# EAGLE design LilyPad-Simple (EAGLE 7.2.0)
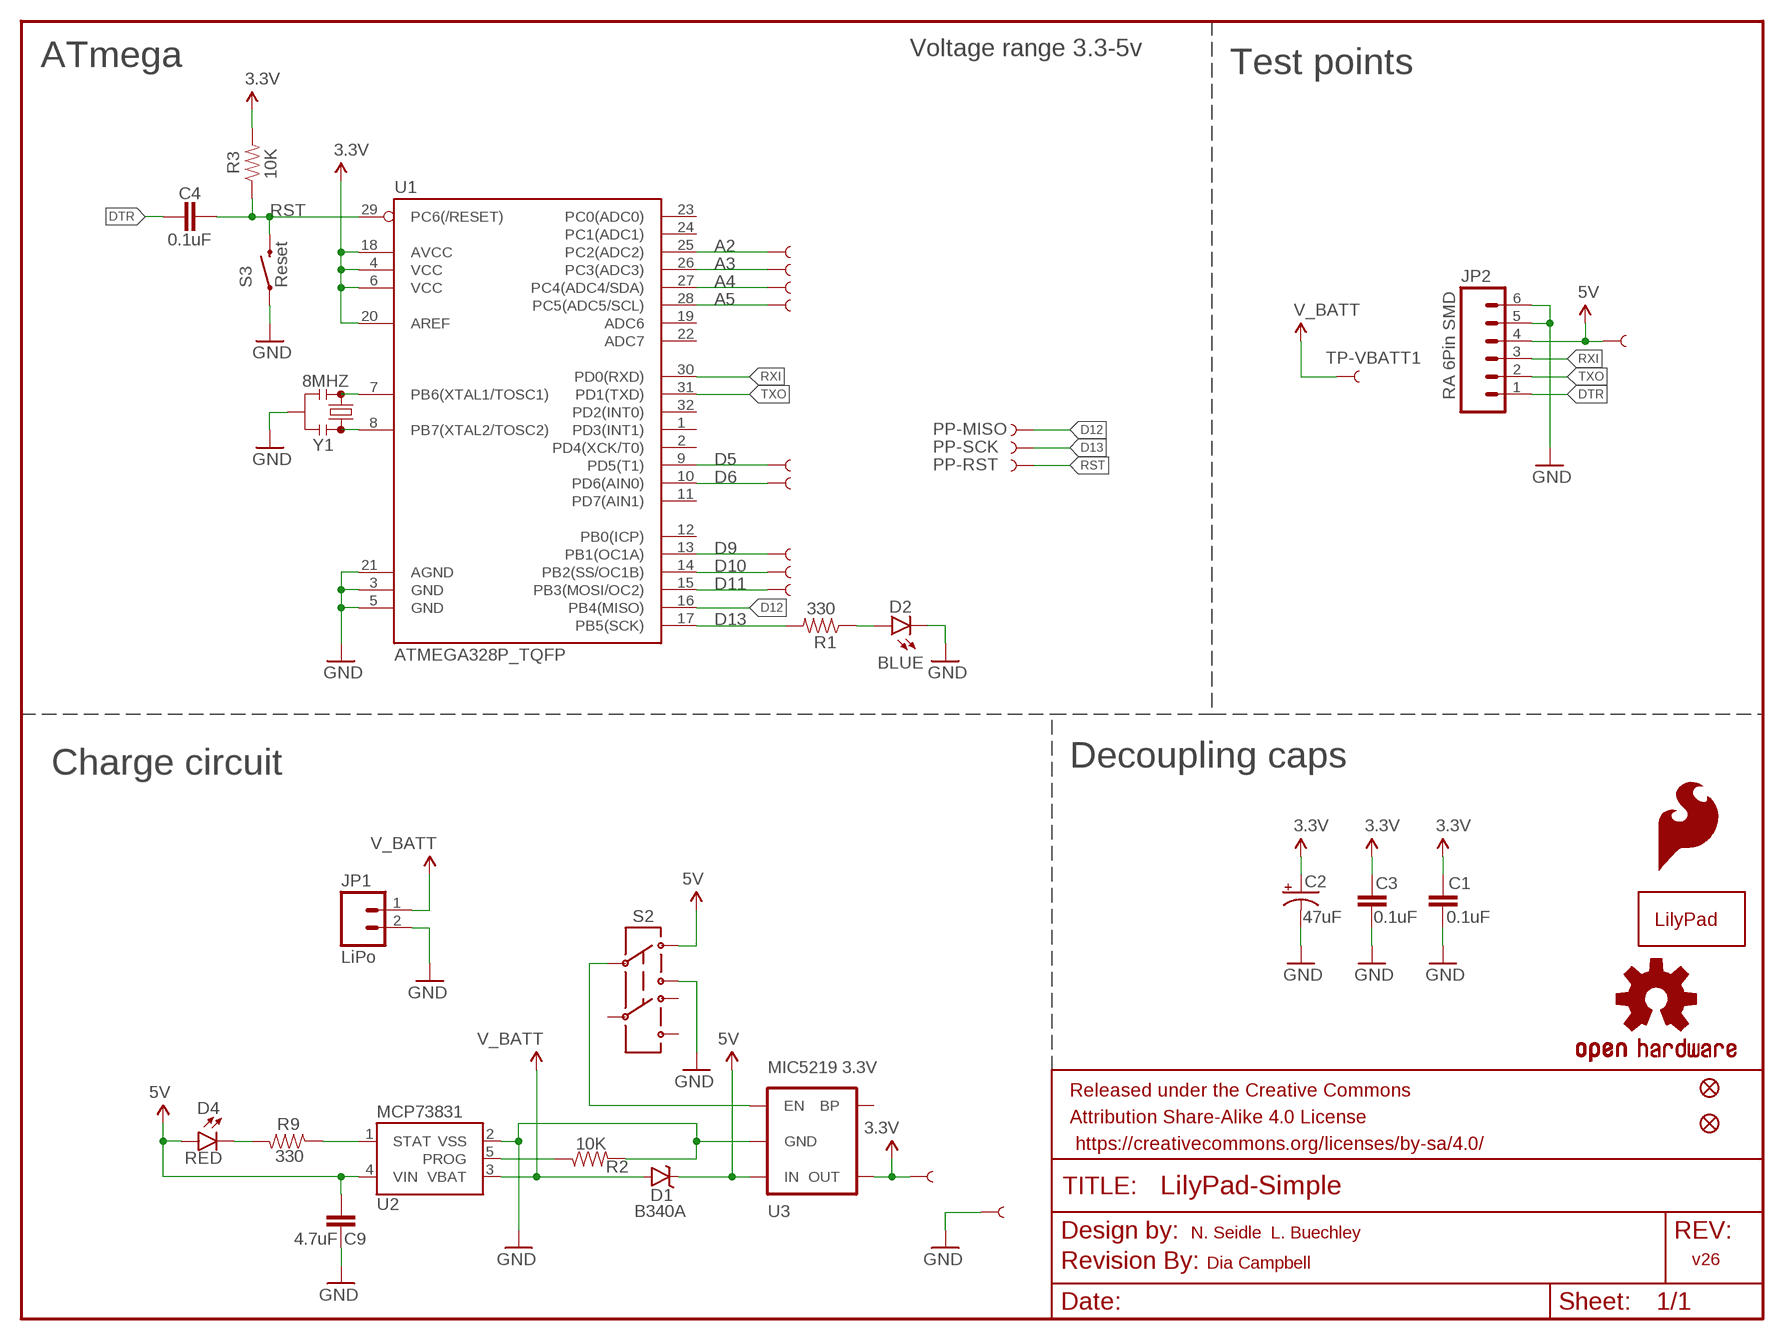
[diagram p0: schematic, sheet 1]

## Parts
A2/16  SEWTAP9  [PETAL-LONG-1-2SIDE]
A3/17  SEWTAP9  [PETAL-LONG-1-2SIDE]
A4/18  SEWTAP9  [PETAL-LONG-1-2SIDE]
A5/19  SEWTAP9  [PETAL-LONG-1-2SIDE]
C1  0.1uF  0.1UF-25V(+80/-20%)(0603)  [0603-CAP]
C2  47uF  47UF-10V-10%(TANT)  [EIA3528]
C3  0.1uF  0.1UF-25V(+80/-20%)(0603)  [0603-CAP]
C4  0.1uF  0.1UF-25V(+80/-20%)(0603)  [0603-CAP]
C9  4.7uF  4.7UF-6.3V-10%(0603)0603  [0603-CAP]
D1  B340A  DIODE-SCHOTTKY-B340A  [SMA-DIODE]
D2  BLUE  LED-BLUE0603  [LED-0603]
D4  RED  LED-RED0603  [LED-0603]
FID1  FIDUCIAL1X2  [FIDUCIAL-1X2]
FID2  FIDUCIAL1X2  [FIDUCIAL-1X2]
FRAME1  FRAME-LETTER  [CREATIVE_COMMONS]
JP1  LiPo  M02-JST-2MM-SMT  [JST-2-SMD]
JP2  RA 6Pin SMD  M06SMD  [1X06-SMD]
LOGO1  OSHW-LOGOM-COPPER  [OSHW-LOGO-M_COPPER]
LOGO2  SFE_LOGO_FLAME.3COP  [SFE_LOGO_FLAME_COPPER_.3]
PP-MISO  TEST-POINT3X5  [PAD.03X.05]
PP-RST  TEST-POINT3X5  [PAD.03X.05]
PP-SCK  TEST-POINT3X5  [PAD.03X.05]
R1  330  330OHM1/10W1%(0603)  [0603-RES]
R2  10K  10KOHM-1/10W-1%(0603)0603  [0603-RES]
R3  10K  10KOHM-1/10W-1%(0603)0603  [0603-RES]
R9  330  330OHM1/10W1%(0603)  [0603-RES]
S2  DPDT  SWITCH-DPDTAYZ0202  [AYZ0202]
S3  Reset  SWITCH-MOMENTARY-2SMD  [TACTILE-SWITCH-SMD]
TP-FTDI_VCC  TEST-POINT3X5  [PAD.03X.05]
TP-VBATT1  TEST-POINT3X5  [PAD.03X.05]
U1  ATMEGA328P_TQFP  [TQFP32-08]
U2  MCP73831  [SOT23-5]
U3  MIC5219 3.3V  V_REG_MIC52193.3V  [SOT23-5]
U$1  REVISION  [REVISION]
U$2  LOGO-LPLPA  [LOGO-LPA]
U$4  SEWTAP9  [PETAL-LONG-1-2SIDE]
U$35  SEWTAP9  [PETAL-LONG-1-2SIDE]
U$37  SEWTAP9  [PETAL-LONG-1-2SIDE]
U$39  SEWTAP9  [PETAL-LONG-1-2SIDE]
U$41  SEWTAP9  [PETAL-LONG-1-2SIDE]
U$43  SEWTAP9  [PETAL-LONG-1-2SIDE]
U$45  SEWTAP9  [PETAL-LONG-1-2SIDE]
Y1  8MHZ  RESONATOR8MHZ  [RESONATOR-SMD]

## Nets
3.3V: C1.1 C2.A(+) C3.1 R3.2 U1.4(VCC) U1.6(VCC) U1.18(AVCC) U1.20(AREF) U3.5(OUT) U$45.1
5V: C9.1 D1.C D4.A JP2.4 S2.1 TP-FTDI_VCC.P$1 U2.4(VIN) U3.1(IN)
A2: A2/16.1 U1.25(PC2(ADC2))
A3: A3/17.1 U1.26(PC3(ADC3))
A4: A4/18.1 U1.27(PC4(ADC4/SDA))
A5: A5/19.1 U1.28(PC5(ADC5/SCL))
D5: U1.9(PD5(T1)) U$41.1
D6: U1.10(PD6(AIN0)) U$35.1
D9: U1.13(PB1(OC1A)) U$37.1
D10: U1.14(PB2(SS/OC1B)) U$39.1
D11: U1.15(PB3(MOSI/OC2)) U$4.1
D12: PP-MISO.P$1 U1.16(PB4(MISO))
D13: PP-SCK.P$1 R1.2 U1.17(PB5(SCK))
DTR: C4.1 JP2.1
GND: C1.2 C2.C(-) C3.2 C9.2 D2.C JP1.2 JP2.5 JP2.6 R2.2 S2.3 S3.1 U1.3(GND) U1.5(GND) U1.21(AGND) U2.2(VSS) U3.2(GND) U$43.1 Y1.2
N$1: U1.7(PB6(XTAL1/TOSC1)) Y1.1
N$2: D2.A R1.1
N$3: U1.8(PB7(XTAL2/TOSC2)) Y1.3
N$6: R2.1 U2.5(PROG)
N$7: S2.2 U3.3(EN)
N$8: D4.C R9.2
RST: C4.2 PP-RST.P$1 R3.1 S3.3 U1.29(PC6(/RESET))
RXI: JP2.3 U1.30(PD0(RXD))
STAT: R9.1 U2.1(STAT)
TXO: JP2.2 U1.31(PD1(TXD))
V_BATT: D1.A JP1.1 TP-VBATT1.P$1 U2.3(VBAT)
Unconnected: S2.4 S2.5 S2.6 U1.1(PD3(INT1)) U1.2(PD4(XCK/T0)) U1.11(PD7(AIN1)) U1.12(PB0(ICP)) U1.19(ADC6) U1.22(ADC7) U1.23(PC0(ADC0)) U1.24(PC1(ADC1)) U1.32(PD2(INT0)) U3.4(BP)

## Notes on the sheet
- Voltage range 3.3-5v
- ATmega | Test points
- Charge circuit | Decoupling caps
- N. Seidle | L. Buechley
- Dia Campbell | v26

## Library data of the parts
A2/16 A3/17 A4/18 A5/19 U$4 U$35 U$37 U$39 U$41 U$43 U$45 = LilyPad-Wearables:SEWTAP: Sew Taps for LilyPad Boards.
C1 C3 C4 = SparkFun-Capacitors:0.1UF-25V(+80/-20%)(0603): CAP-00810 Ceramic Standard decoupling cap; PROD_ID: CAP-00810
C2 = SparkFun-Capacitors:47UF-10V-10%(TANT): CAP-08310 47uF Tantalum SMT 10V 10% (EIA-3528); PROD_ID: CAP-08310
C9 = SparkFun-Capacitors:4.7UF-6.3V-10%(0603): CAP-08280; PROD_ID: CAP-08280
D1 = SparkFun-DiscreteSemi:DIODE-SCHOTTKY: Schottky diodes in SFE's production catalog BAT20J 1A 23V 0.62Vf RB751 120mA 40V 0.37Vf PMEG4005EJ 0.5A 40V 0.42Vf MBRA140 1A 40V 0.5Vf B340A 3A 40V SMA; PROD_ID: DIO-09886
D2 = SparkFun-LED:LED-BLUE: Blue LEDs for production use Various blue LEDs stocked by SparkFun production 0603 - DIO-08575 Rebel - DIO-09553 1206 - DIO-09911; PROD_ID: DIO-08575
D4 = SparkFun-LED:LED-RED: Assorted Red LEDs LilyPad 1206- DIO-09912 1206- DIO-00809 0603- DIO-00819 "SMART" means more efficient and expensive; PROD_ID: DIO-00819
FID1 FID2 = SparkFun-Aesthetics:FIDUCIAL: Fiducial Alignment Points Various fiducial points for machine vision alignment.
FRAME1 = SparkFun-Aesthetics:FRAME-LETTER: Schematic Frame Standard 8.5x11 US Letter frame
JP1 = SparkFun-Connectors:M02: Standard 2-pin 0.1" header. Use with - straight break away headers ( PRT-00116) - right angle break away headers (PRT-00553) - swiss pins (PRT-00743) - machine pins (PRT-00117) - female headers (PRT-00115) Molex polarized connector foot print use with: PRT-08233 with associated crimp pins and housings. 2.54_SCREWTERM for use with PRT-10571. 3.5mm Screw Terminal footprints for PRT-08084 5mm Screw Terminal footprints for use with PRT-08432; PROD_ID: CONN-11443
JP2 = SparkFun-Connectors:M06: Header 6 Standard 6-pin 0.1" header. Use with straight break away headers (SKU : PRT-00116), right angle break away headers (PRT-00553), swiss pins (PRT-00743), machine pins (PRT-00117), and female headers (PRT-00115). Molex polarized connector foot print use with SKU : PRT-08094 with associated crimp pins and housings. NOTES ON THE VARIANTS LOCK and LOCK_LONGPADS... This footprint was designed to help hold the alignment of a through-hole component (i.e. 6-pin header) while soldering it into place. You may notice that each hole has been shifted either up or down by 0.005 of an inch from it's more standard position (which is a perfectly straight line). This slight alteration caused the pins (the squares in the middle) to touch the edges of the holes. Because they are alternating, it causes a "brace" to hold the component in place. 0.005 has proven to be the perfect amount of "off-center" position when using our standard breakaway headers. Although looks a little odd when you look at the bare footprint, once you have a header in there, the alteration is very hard to notice. Also,if you push a header all the way into place, it is covered up entirely on the bottom side. This idea of altering the position of holes to aid alignment will be further integrated into the Sparkfun Library for other footprints. It can help hold any component with 3 or more connection pins.; PROD_ID: CONN-08971
LOGO1 = SparkFun-Aesthetics:OSHW-LOGO: Open Source Hardware Logo This logo indicates the piece of hardware it is found on incorporates a OSHW license and/or adheres to the definition of open source hardware found here: http://freedomdefined.org/OSHW
LOGO2 = SparkFun-Aesthetics:SFE_LOGO_FLAME: SFE Logo, flame only This is the SparkFun flame logo. The logo on the schematic will always be the same size; the package variant is the height of the flame. Default layer for the logo on the board is tSilk.
PP-MISO PP-RST PP-SCK TP-FTDI_VCC TP-VBATT1 = SparkFun:TEST-POINT
R1 R9 = SparkFun-Resistors:330OHM1/10W1%(0603): RES-00818; PROD_ID: RES-00818
R2 R3 = SparkFun-Resistors:10KOHM-1/10W-1%(0603): RES-00824; PROD_ID: RES-00824
S2 = SparkFun-Electromechanical:SWITCH-DPDT: DPDT Version of the COM-00597; PROD_ID: SWCH-08179
S3 = SparkFun-Electromechanical:SWITCH-MOMENTARY-2: Various NO switches- pushbuttons, reed, etc; PROD_ID: SWCH-08247
U1 = SparkFun-DigitalIC:ATMEGA328P_TQFP; PROD_ID: IC-09069
U2 = SparkFun-PowerIC:MCP73831: Miniature single cell, fully integrated Li-Ion, Li-polymer charge management controller http://ww1.microchip.com/downloads/en/DeviceDoc/20001984g.pdf IC-09995; PROD_ID: IC-09995
U3 = SparkFun-PowerIC:V_REG_MIC5219: V_REG MIC5219 Standard 3.3V and 5V 500mA LDO voltage regulator in SOT-23 layout. Micrel part MIC5219. BP (by-pass) pin is used to lower output noise with 470pF cap, may be left open.; PROD_ID: VREG-09872
U$1 = SparkFun-Aesthetics:REVISION
U$2 = LilyPad-Wearables:LOGO-LP
Y1 = SparkFun-FreqCtrl:RESONATOR: Resonator Small SMD resonator. Used, eg, on the Arduino Pro/ Pro Mini boards. 8MHz- XTAL-08895 16MHz- XTAL-08900; PROD_ID: XTAL-08895

## Net classes
0 Default: width 0.203 mm
1 VCC: width 0.254 mm

## Board
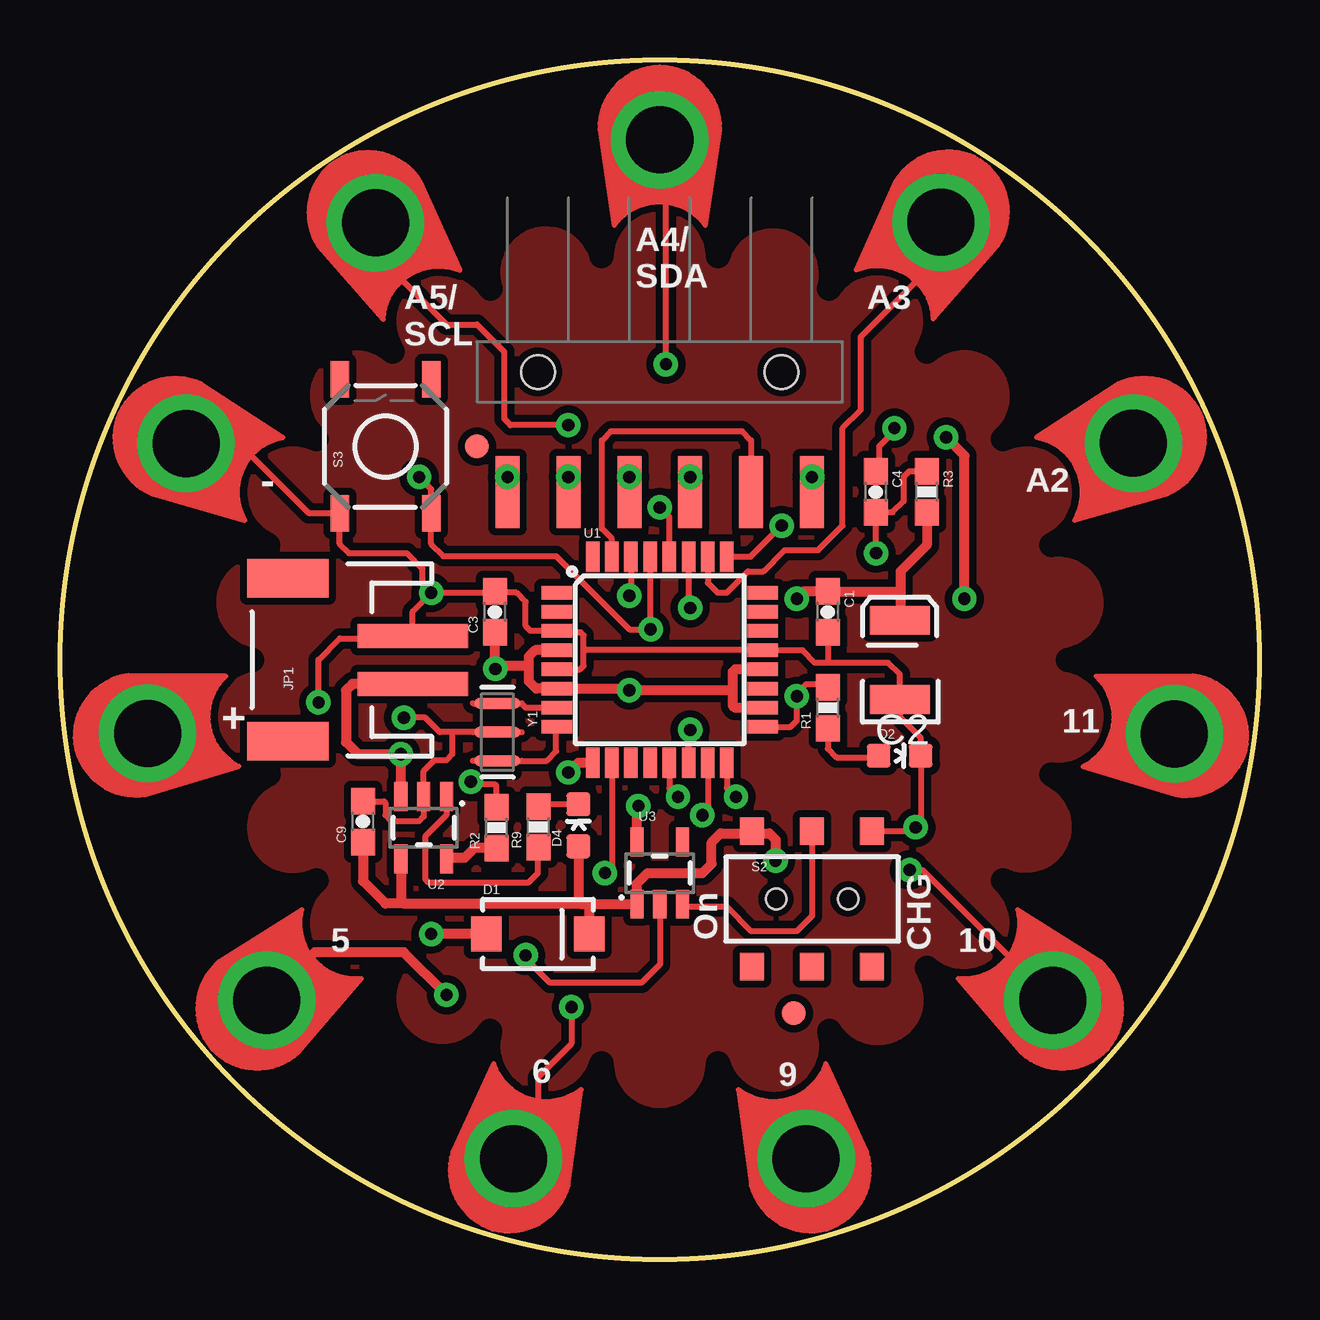
[diagram p1: board, top side]
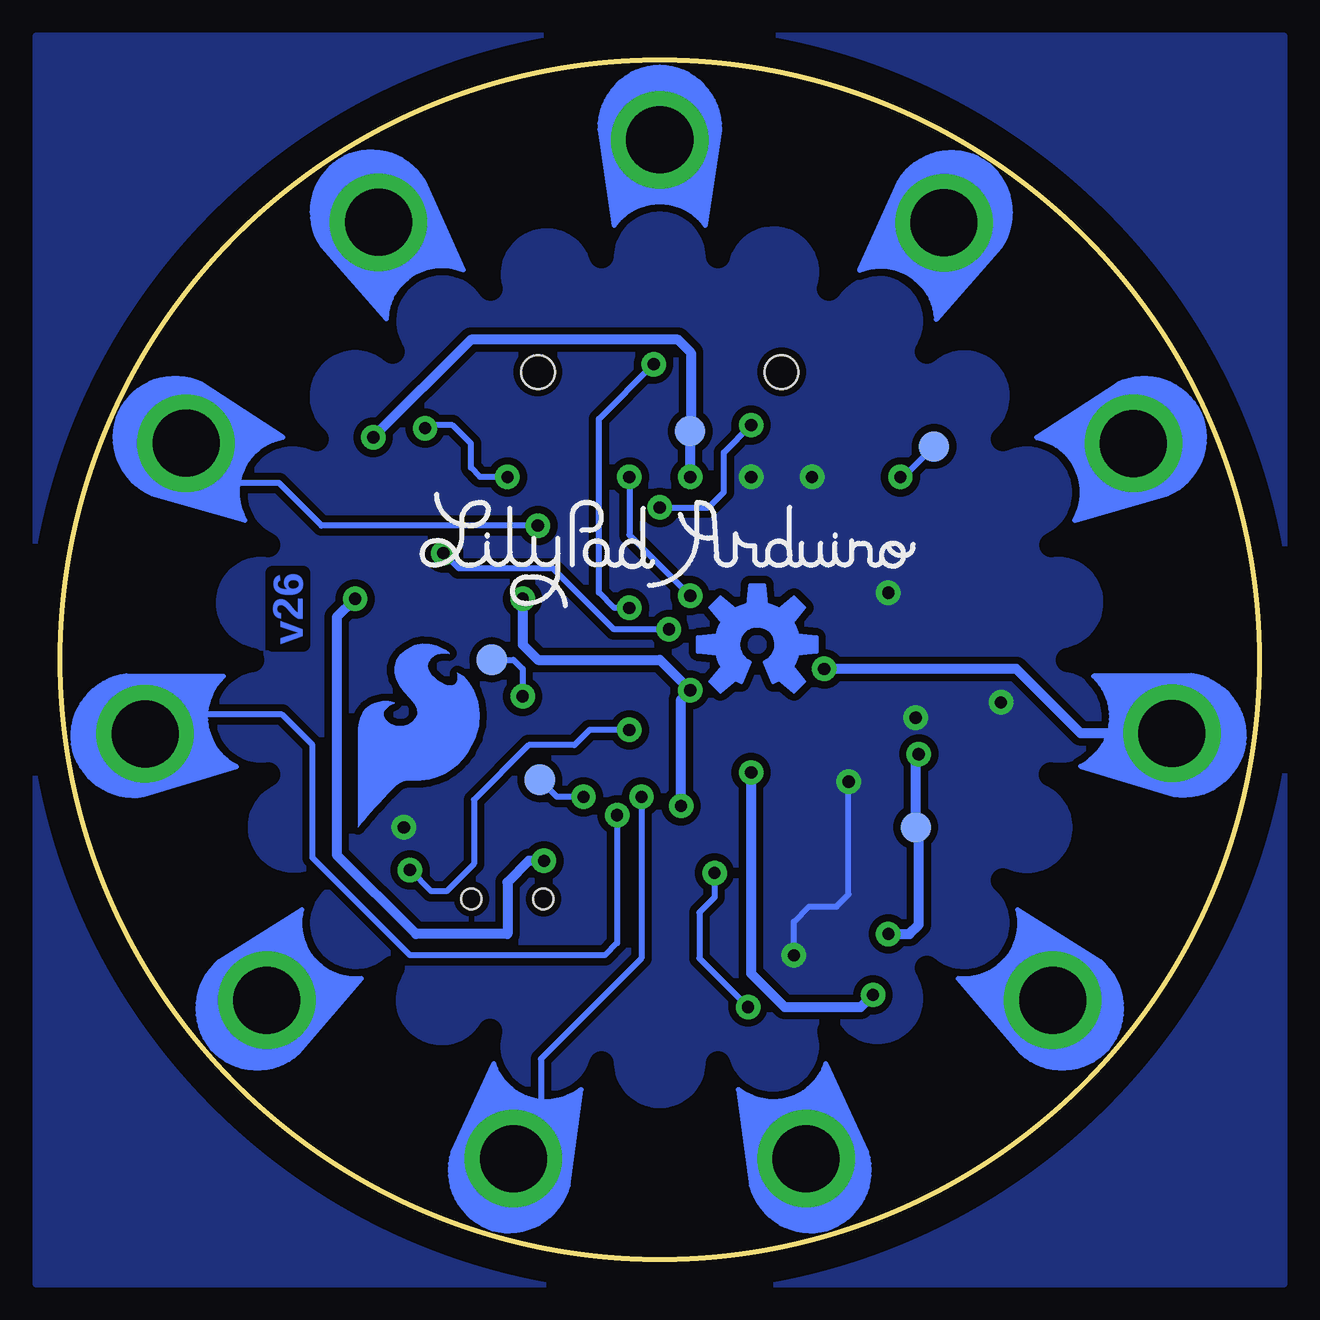
[diagram p2: board, bottom side, seen from below]

Size 50 x 50 mm. Coordinates in mm from the lower left corner, seen from the top.
Outline: circle at 25,25 radius 25
Copper layers (1*16): Top 0.035mm / dielectric 1.5mm / Bottom 0.035mm
Design rules "SparkFun-2-layer": minimum track width 7mil, minimum drill 15mil, track to track 8mil, track to pad 8mil, pad to pad 8mil, via to via 8mil, smd to smd 8mil, copper to edge 8mil, drill to drill 8mil, minimum pad ring 12mil, minimum via ring 10mil, stop-mask expansion 4mil, vias tented up to drill 20mil, thermal gap 10mil
tRestrict: area 2.4,2.4 to 47.6,47.6; area 21,42.8 to 23.5,44; area 31.6,41.3 to 34.4,43; area 36.3,38.4 to 38.9,40.7; area 40,34.1 to 42,36.9; area 42.2,29.2 to 43.6,31.8; area 42.8,23.9 to 44,26.2; area 42.2,18.2 to 43.7,20.9; area 36.3,9.4 to 39,11.7; area 31.7,7 to 34.5,8.7; area 26.5,6 to 28.9,7.3; area 21.1,6 to 23.6,7.3; area 15.6,7 to 18.3,8.7; area 11,9.3 to 13.8,11.6; area 8,13.1 to 10.1,15.9; area 6.4,18.2 to 8,20.8; area 6,23.7 to 7.2,26.2; area 6.3,29.1 to 7.9,31.7; area 8,34 to 10.1,36.9; area 11,38.3 to 13.7,40.6; area 15.4,41.2 to 18.4,43; area 26.4,42.5 to 29.1,44; area 40,13 to 42,16.1; 22 lines
bRestrict: area 2.4,2.4 to 47.6,47.6; area 21,42.8 to 23.5,44; area 31.6,41.3 to 34.4,43; area 36.3,38.4 to 38.9,40.7; area 40,34.1 to 42,36.9; area 42.2,29.2 to 43.6,31.8; area 42.8,23.9 to 44,26.2; area 42.2,18.2 to 43.7,20.9; area 36.3,9.4 to 39,11.7; area 31.7,7 to 34.5,8.7; area 26.5,6 to 28.9,7.3; area 21.1,6 to 23.6,7.3; area 15.6,7 to 18.3,8.7; area 11,9.3 to 13.8,11.6; area 8,13.1 to 10.1,15.9; area 6.4,18.2 to 8,20.8; area 6,23.7 to 7.2,26.2; area 6.3,29.1 to 7.9,31.7; area 8,34 to 10.1,36.9; area 11,38.3 to 13.7,40.6; area 15.4,41.2 to 18.4,43; area 26.4,42.5 to 29.1,44; area 40,13 to 42,16.1; 22 lines

### Footprints (pad centres in the part's own frame; a part is rotated, then mirrored left to right if it is on the bottom)
PETAL-LONG-1-2SIDE = drill 2.794 pad 4.064: 1 0.03,0
0603-CAP = smd 1.1 x 1: 1 -0.85,0; 2 0.85,0
EIA3528 = smd 1.2 x 2.5: A 1.65,0; C -1.65,0
SMA-DIODE = smd 1.27 x 1.47: A -2.15,0; C 2.15,0
LED-0603 = smd 1 x 1: A 0,-0.877; C 0,0.877
FIDUCIAL-1X2 = smd 1 x 1: 1 0,0
JST-2-SMD = smd 1 x 4.6: 1 -1,-3.7; 2 1,-3.7 | smd 1.6 x 3.4: NC1 -3.4,1.5; NC2 3.4,1.5
1X06-SMD = smd 1 x 3: 1 -6.35,5; 2 -3.81,5; 3 -1.27,5; 4 1.27,5; 5 3.81,5; 6 6.35,5 | hole 1.4: -5.08,0; 5.08,0
PAD.03X.05 = smd 1.27 x 1.27: P$1 0,0
0603-RES = smd 1.1 x 1: 1 -0.85,0; 2 0.85,0
AYZ0202 = smd 1 x 1.15: 1 -2.5,2.825; 2 0,2.825; 3 2.5,2.825; 4 -2.5,-2.825; 5 0,-2.825; 6 2.5,-2.825 | hole 0.85: 1.5,0; -1.5,0
TACTILE-SWITCH-SMD = smd 1.524 x 0.762: 1 -2.794,1.905; 2 2.794,1.905; 3 -2.794,-1.905; 4 2.794,-1.905
TQFP32-08 = smd 1.27 x 0.559: 1 -4.293,2.8; 2 -4.293,2; 3 -4.293,1.2; 4 -4.293,0.4; 5 -4.293,-0.4; 6 -4.293,-1.2; 7 -4.293,-2; 8 -4.293,-2.8; 17 4.293,-2.8; 18 4.293,-2; 19 4.293,-1.2; 20 4.293,-0.4; 21 4.293,0.4; 22 4.293,1.2; 23 4.293,2; 24 4.293,2.8 | smd 0.559 x 1.27: 9 -2.8,-4.293; 10 -2,-4.293; 11 -1.2,-4.293; 12 -0.4,-4.293; 13 0.4,-4.293; 14 1.2,-4.293; 15 2,-4.293; 16 2.8,-4.293; 25 2.8,4.293; 26 2,4.293; 27 1.2,4.293; 28 0.4,4.293; 29 -0.4,4.293; 30 -1.2,4.293; 31 -2,4.293; 32 -2.8,4.293
SOT23-5 = smd 0.55 x 1.2: 1 -0.95,-1.3; 2 0,-1.3; 3 0.95,-1.3; 4 0.95,1.3; 5 -0.95,1.3
RESONATOR-SMD = smd 0.45 x 1.905: 1 -1.2,0; 2 0,0; 3 1.2,0

### Placement (x,y rotation side)
A2/16  44.77,34.04 204.5 top
A3/17  36.74,43.26 237.3 top
A4/18  25,46.7 270 top
A5/19  13.13,43.24 302.7 top
C1  32,27 270 top
C2  35,25 90 top
C3  18.13,27 90 top
C4  34,32 270 top
C9  12.63,18.25 90 top
D1  19.92,13.57 0 top
D2  35,21 270 top
D4  21.61,18.1 0 top
FID1  17.38,33.89 0 top
FID2  30.59,10.27 0 top
FRAME1  -95.55,25 0 top  (outside the outline)
JP1  11,25 90 top
JP2  25,37 180 top
LOGO1  20.94,25.64 0 bottom
LOGO2  38.08,17.89 0 bottom
PP-MISO  30,20 0 bottom
PP-RST  13.57,33.89 0 bottom
PP-SCK  32,25 0 bottom
R1  32,23 90 top
R2  18.19,18 90 top
R3  36.13,32 270 top
R9  19.94,18.03 90 top
S2  31.35,15.03 0 top
S3  13.57,33.89 90 top
TP-FTDI_VCC  23.73,34.52 0 bottom
TP-VBATT1  14.33,18.02 0 bottom
U1  25,25 0 top
U2  15.16,18 180 top
U3  25,16.11 0 top
U$1  -84.22,21.19 0 top  (outside the outline)
U$2  24.87,29.95 0 bottom
U$4  46.48,21.91 171.8 top
U$35  18.89,4.17 73.7 top
U$37  31.11,4.17 106.3 top
U$39  41.4,10.79 139.1 top
U$41  8.6,10.79 40.9 top
U$43  5.23,34.03 335.5 top
U$45  3.62,21.92 8.2 top
Y1  18.23,21.98 270 top

### Tracks (layer width: path | path; a pad name or v marks a point on that pad's centre or on a via)
3.3V  (via drill 0.51)
  Top 0.254: 35.03,26.68 C2.A | 34.98,27.85 35.03,27.79
  Top 0.406: 35.03,26.68 35.03,27.79 35.03,28.68 36.13,29.78 R3.2 | 34.98,27.85 C1.1 31.02,27.85 v30.71,27.54 | U1.4 19.81,25.4 19.54,25.13 19.54,24.75 | 19.54,24.75 19.54,24.11 19.85,23.8 U1.6 23.66,23.8 v23.73,23.73 28.05,23.73 | 19.54,24.75 18.27,24.75 v18.14,24.62 18.14,26.14 C3.1 | U3.5 24.05,18.84 v24.11,18.9 | U1.20 28.16,24.6 28.05,24.49 28.05,23.73 | U1.18 28.14,23 28.05,23.09 28.05,23.73
  Bottom 0.406: v24.11,18.9 24.11,23.35 v23.73,23.73 25,25 30.08,25 30.71,25.64 v30.71,27.54 | U$45.1 7.45,21.93 10.14,24.62 v18.14,24.62
5V  (via drill 0.51)
  Top 0.254: U2.4 | JP2.4 v23.73,32.62
  Top 0.406: 28.76,17.76 29.57,17.76 29.83,17.51 v29.83,16.62 | v37.7,27.54 37.7,33.51 v36.94,34.27 | 21.95,14.81 U3.1 24.05,15.67 24.49,16.11 26.78,16.11 27.16,16.49 27.16,17.38 27.54,17.76 28.76,17.76 | 21.95,14.81 21.73,14.81 21.7,14.84 | 28.76,17.76 S2.1 | 14.33,14.84 21.7,14.84 | D4.A 21.61,14.93 21.7,14.84 | 14.33,14.84 13.57,14.84 12.63,15.78 C9.1 | U2.4 14.21,14.96 14.33,14.84 | D1.C 22.07,14.69 21.95,14.81
  Bottom 0.254: 23.7,34.55 TP-FTDI_VCC.P$1
  Bottom 0.406: v37.7,27.54 38.46,26.78 38.46,16.87 35.16,13.57 31.35,13.57 31.35,15.73 30.46,16.62 v29.83,16.62 | v36.94,34.27 32.87,38.34 24.24,38.34 23.7,37.8 23.7,34.55 | TP-FTDI_VCC.P$1 v23.73,32.62
A2  (via drill 0.51)
  Top 0.254: U1.25 28.79,29.29 v30.08,30.59
  Bottom 0.254: v30.08,30.59 39.1,30.59 40.88,32.37 43.08,32.37 A2/16.1
A3
  Top 0.254: A3/17.1 36.72,41.8 33.38,38.46 33.38,35.41 32.62,34.65 32.62,30.59 31.6,29.57 30.21,29.57 29.32,28.68 28.68,28.68 27.79,27.79 27.41,27.79 27,28.21 U1.26
A4  (via drill 0.51)
  Top 0.254: U1.27 26.2,27.23 v26.27,27.16 | v25.25,37.32 25.25,46.42 A4/18.1
  Bottom 0.254: v26.27,27.16 26.91,27.16 27.54,27.79 27.54,35.03 v25.25,37.32
A5  (via drill 0.51)
  Top 0.254: U1.28 25.4,30.95 v25,31.35 | v21.19,34.78 18.78,34.78 18.52,35.03 18.52,37.83 17.38,38.97 16.11,38.97 13.15,41.93 A5/19.1
  Bottom 0.254: v25,31.35 22.97,31.35 22.33,31.98 22.33,33.64 v21.19,34.78
D5  (via drill 0.51)
  Top 0.406: U1.9 21.6,20.71 v21.19,20.3 | v16.11,11.03 14.33,12.81 10.62,12.81 U$41.1
  Bottom 0.406: v21.19,20.3 21.19,11.92 19.79,10.52 16.62,10.52 v16.11,11.03 | 8.91,10.52 U$41.1
D6  (via drill 0.51)
  Top 0.254: U1.10 23,16.4 v22.71,16.11 | v21.32,10.52 21.32,9 19.92,7.6 19.92,5.22 U$35.1
  Bottom 0.254: v22.71,16.11 22.71,15.09 23.35,14.46 23.35,12.55 v21.32,10.52
D9  (via drill 0.51)
  Top 0.254: U$37.1 31.1,5.82 | U1.13 25.4,19.65 v25.76,19.29
  Bottom 0.254: v25.76,19.29 25.76,12.55 29.95,8.36 29.95,5.35 U$37.1
D10  (via drill 0.51)
  Top 0.254: U1.14 26.2,22.01 v26.27,22.08 | v35.41,16.24 35.95,16.24 U$39.1
  Bottom 0.254: v26.27,22.08 27.92,22.08 28.56,21.44 30.46,21.44 32.75,19.16 32.75,16.49 33.89,15.35 34.52,15.35 v35.41,16.24
D11  (via drill 0.51)
  Top 0.254: U1.15 27,18.75 v26.78,18.52
  Bottom 0.254: v26.78,18.52 26.78,13.19 27.29,12.68 35.41,12.68 39.48,16.74 39.48,21.44 40.75,22.71 45.65,22.71 U$4.1
D12  (via drill 0.51)
  Top 0.254: U1.16 27.8,19.66 v28.18,19.29
  Bottom 0.254: v28.18,19.29 29.29,19.29 PP-MISO.P$1
D13  (via drill 0.51)
  Top 0.254: R1.2 31.87,23.98 31.1,23.98 30.71,23.6 v30.71,23.48 30.71,22.46 30.45,22.2 U1.17
  Bottom 0.254: PP-SCK.P$1 31.1,25 30.71,24.62 v30.71,23.48
DTR  (via drill 0.51)
  Top 0.254: v34.78,34.65 34.78,34.52 34.14,33.89 34.14,32.99 C4.1 | v31.35,32.62 JP2.1
  Bottom 0.254: 31.4,32.67 v31.35,32.62 32.49,32.62 32.87,33 32.87,34.02 33.64,34.78 34.65,34.78 v34.78,34.65
GND  (via drill 0.51)
  Top 0.254: U1.5 21.68,24.6 21.82,24.75 21.82,25.51 | 21.82,25.51 21.82,26.02 21.7,26.14 21.19,26.14 21.13,26.2 U1.3 19.61,26.2 19.41,26.4 19.41,27.41 19.03,27.79 18.18,27.79 C3.2 18.07,27.79 v15.47,27.79 | 21.82,25.51 21.93,25.4 U1.21 30.95,25.4 31.48,24.87 31.98,24.87 | 7.6,34.02 U$43.1 7.47,34.02 10.39,31.1 S3.1 11.66,29.83 12.05,29.45 14.46,29.45 15.09,28.81 15.09,28.18 v15.47,27.79 | U3.2 25,12.3 24.24,11.54 20.43,11.54 19.41,12.55 v19.41,12.68 | C1.2 32,24.89 31.98,24.87 | v15.47,27.79 14.7,27.02 JP1.2 14.59,25.89 11.66,25.89 10.78,25 v10.78,23.22 | JP2.5 v21.19,32.62 | 17.21,21.98 16.36,21.98 | 16.36,21.98 15.82,21.98 15.22,22.59 v14.33,22.59 | 16.36,21.98 16.36,21.06 16.11,20.81 15.6,20.81 15.16,20.37 U2.2 15.16,18.46 14.97,18.27 13.82,18.27 13.57,18.52 13.57,19.03 13.5,19.1 C9.2 | R2.2 18.19,19.74 18.14,19.79 17.25,19.79 v17.13,19.92 | 31.98,24.87 34.52,24.87 35,24.4 C2.C 35,22.62 35.88,21.74 D2.C 35.88,18.22 v35.67,18.02 35.51,17.86 S2.3
  Top 0.406: JP2.6 v18.65,32.62
  Bottom 0.254: v19.41,12.68 19.41,14.08 18.78,14.71 17.63,14.71 17.13,15.22 v17.13,19.92 | v14.33,22.59 14.46,22.59
  pour Bottom (isolate 0.305): -1,51 51,51 51,-1 -1,-1
N$1
  Top 0.254: U1.7 19.43,23 19.24,23.18
N$2
  Top 0.254: R1.1 32,21.3 32.37,20.94 34.06,20.94 D2.A
N$3
  Top 0.254: 19.24,20.78 20.28,20.78 20.68,21.19 20.68,22.18 U1.8
N$6
  Top 0.254: 16.15,16.74 U2.5
  Top 0.406: R2.1 17.28,17.15 16.87,16.74 16.15,16.74
N$7
  Top 0.254: S2.2 31.35,14.33 30.71,13.7 28.81,13.7 27.79,14.71 26.05,14.71 U3.3
N$8
  Top 0.254: D4.C 20.04,18.98 R9.2
N$11
  pour Top (isolate 0.305): -0.4,25 arc-90 25,50.4 arc-95 50.4,22.46 arc-85 25,-0.4 arc-89
RST  (via drill 0.51)
  Top 0.254: v34.02,29.45 34.02,31.13 C4.2 34.71,31.15 35.16,31.6 35.16,32.62 35.39,32.85 R3.1 | U1.29 24.6,26.29 v24.62,26.27 23.73,26.27 20.68,29.32 15.98,29.32 15.47,29.83 S3.3 15.47,32.11 v14.97,32.62
  Bottom 0.254: v34.02,29.45 33.38,28.81 29.45,28.81 26.91,26.27 v24.62,26.27 | v14.97,32.62 14.84,32.62 PP-RST.P$1
RXI  (via drill 0.51)
  Top 0.254: U1.30 23.8,27.74 v23.73,27.67 | v26.27,32.62 JP2.3
  Bottom 0.254: v26.27,32.62 26.27,30.21 v23.73,27.67
STAT
  Top 0.254: U2.1 16.11,18.52 15.22,17.63 15.22,15.86 15.35,15.73 19.54,15.73 19.92,16.11 19.92,17.16 R9.1
TXO
  Top 0.254: U1.31 23,30.05 22.59,30.46 22.59,34.14 22.97,34.52 28.43,34.52 28.81,34.14 JP2.2
V_BATT  (via drill 0.51)
  Top 0.406: D1.A v15.47,13.57 | U2.3 v14.21,21.06 12.43,21.06 11.92,21.57 11.92,23.73 12.19,24 JP1.1
  Bottom 0.406: v15.47,13.57 14.59,13.57 14.21,13.95 14.21,17.89 TP-VBATT1.P$1 14.33,20.94 v14.21,21.06

### Text on the board
Bottom: v26
tPlace: A4/ / SDA | A3 | A5/ / SCL | - | A2 | + | 11 | CHG | 5 | On | 10 | 6 | 9
tValues: Green
Measures: Dimension in inches
tDocu: Purple 0.8mm | N. Seidle L. Buechley | Dia Campbell